# EAGLE schematic Extrudrboard2-thunk (EAGLE 6.2)
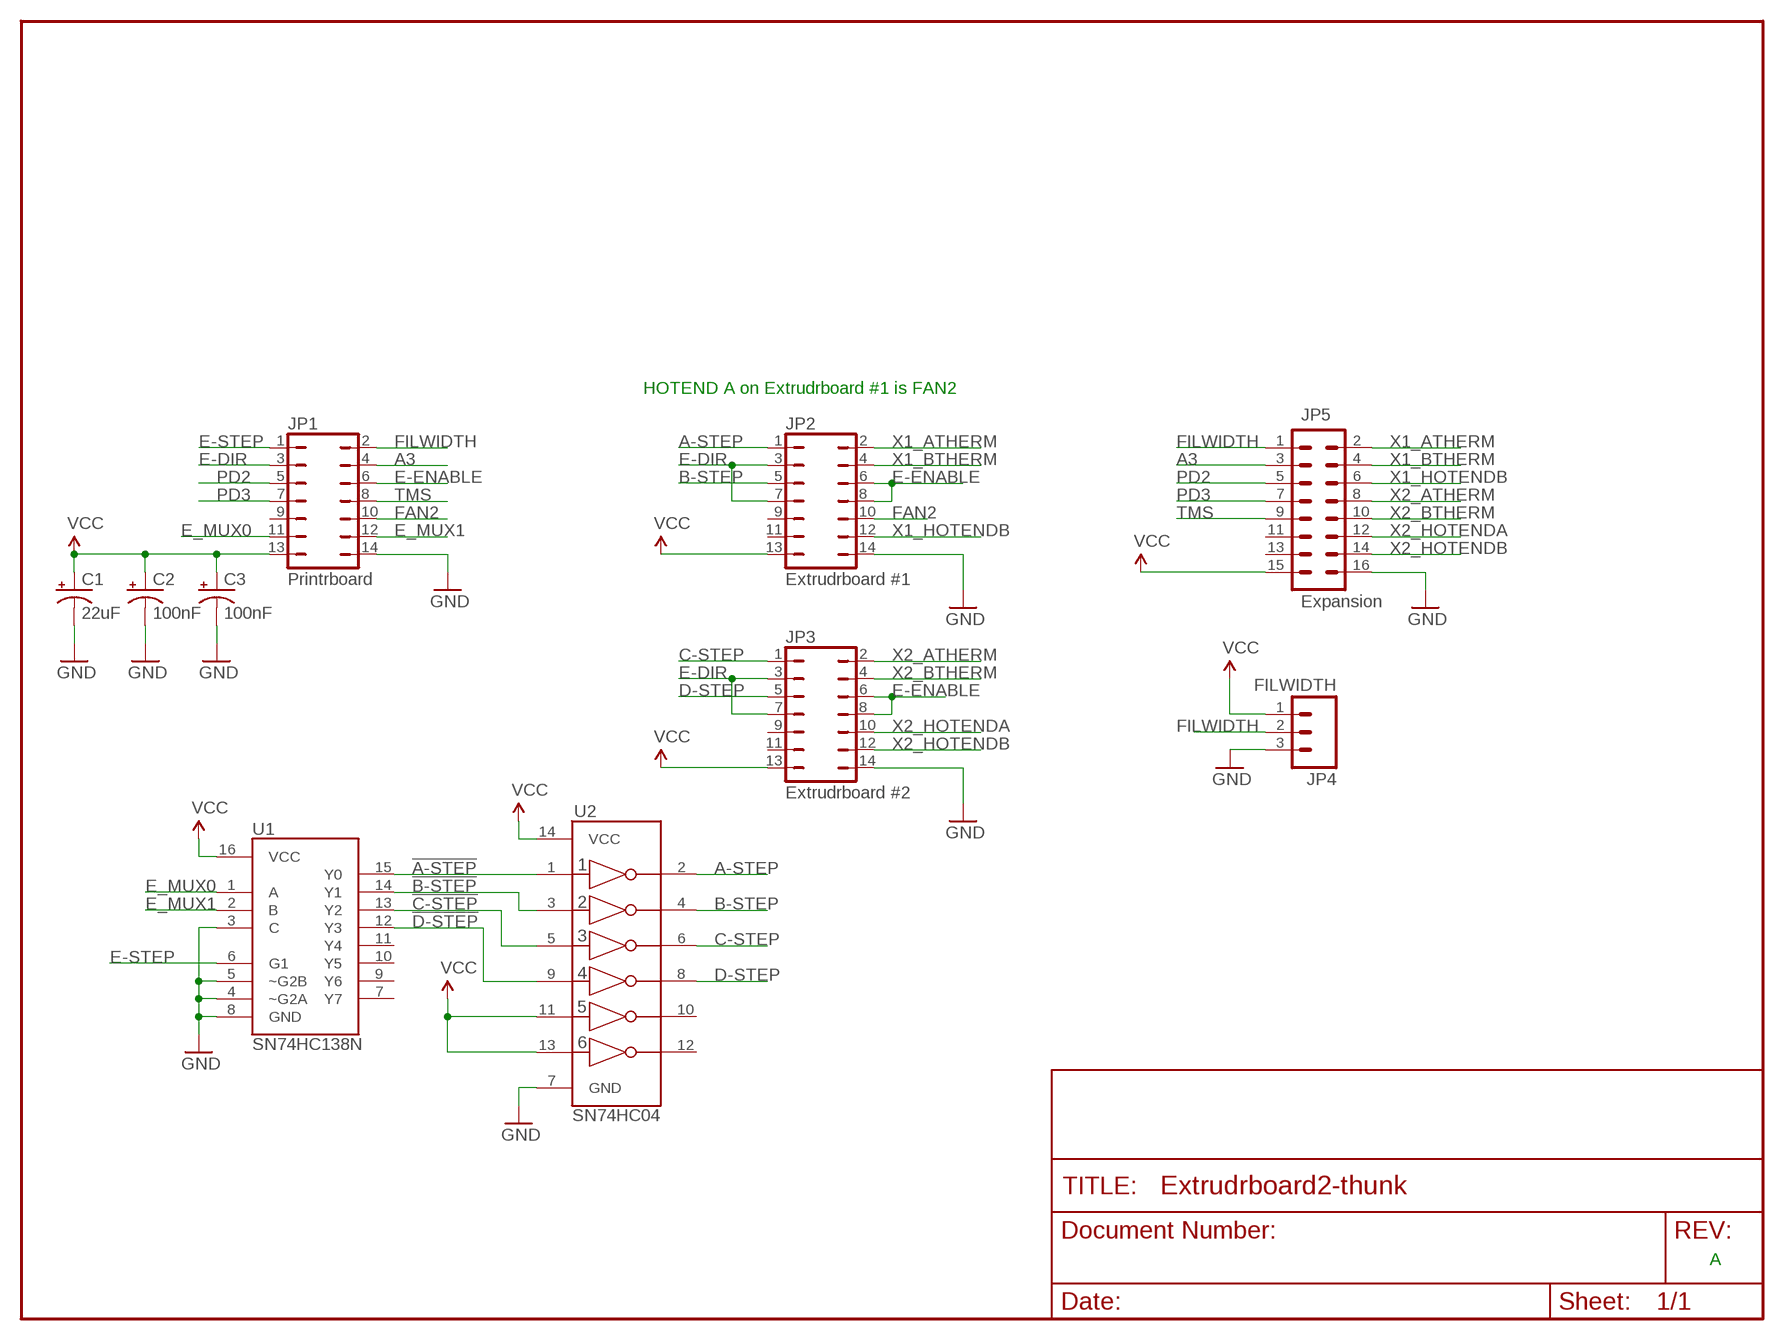
[diagram p0: schematic, sheet 1]

## Parts
C1  22uF  CAP_POLPTH1  [CPOL-RADIAL-100UF-25V]
C2  100nF  CAP_POLPTH2  [CPOL-RADIAL-10UF-25V]
C3  100nF  CAP_POLPTH2  [CPOL-RADIAL-10UF-25V]
JP1  Printrboard  JP7Q  [JP7Q]
JP2  Extrudrboard #1  JP7Q  [JP7Q]
JP3  Extrudrboard #2  JP7Q  [JP7Q]
JP4  FILWIDTH  M03PTH  [1X03]
JP5  Expansion  M08X2  [2X8]
U1  SN74HC138N  M74HC238  [DIL16]
U2  SN74HC04  74HC04_HEX_INVERTER  [DIL14]

## Nets
!A-STEP: U1.15(Y0) U2.1(1A)
!B-STEP: U1.14(Y1) U2.3(2A)
!C-STEP: U1.13(Y2) U2.5(3A)
!D-STEP: U1.12(Y3) U2.9(4A)
A3: JP1.4 JP5.3
A-STEP: JP2.1 U2.2(1Y)
B-STEP: JP2.5 U2.4(2Y)
C-STEP: JP3.1 U2.6(3Y)
D-STEP: JP3.5 U2.8(4Y)
E-DIR: JP1.3 JP2.3 JP2.7 JP3.3 JP3.7
E-ENABLE: JP1.6 JP2.6 JP2.8 JP3.6 JP3.8
E-STEP: JP1.1 U1.6(G1)
E_MUX0: JP1.11 U1.1(A)
E_MUX1: JP1.12 U1.2(B)
FAN2: JP1.10 JP2.10
FILWIDTH: JP1.2 JP4.2 JP5.1
GND [Power]: C1.2(-) C2.2(-) C3.2(-) JP1.14 JP2.14 JP3.14 JP4.3 JP5.16 U1.3(C) U1.4(~G2A) U1.5(~G2B) U1.8(GND) U2.7(GND)
PD2: JP1.5 JP5.5
PD3: JP1.7 JP5.7
TMS: JP1.8 JP5.9
VCC [Power]: C1.1(+) C2.1(+) C3.1(+) JP1.13 JP2.13 JP3.13 JP4.1 JP5.15 U1.16(VCC) U2.11(5A) U2.13(6A) U2.14(VCC)
X1_ATHERM: JP2.2 JP5.2
X1_BTHERM: JP2.4 JP5.4
X1_HOTENDB: JP2.12 JP5.6
X2_ATHERM: JP3.2 JP5.8
X2_BTHERM: JP3.4 JP5.10
X2_HOTENDA: JP3.10 JP5.12
X2_HOTENDB: JP3.12 JP5.14
Unconnected: JP1.9 JP2.9 JP2.11 JP3.9 JP3.11 JP5.11 JP5.13 U1.7(Y7) U1.9(Y6) U1.10(Y5) U1.11(Y4) U2.10(5Y) U2.12(6Y)

## Notes on the sheet
- HOTEND A on Extrudrboard #1 is FAN2
- A

## Library data of the parts
C1-C3 = SparkFun:CAP_POL: Capacitor Polarized These are standard SMD and PTH capacitors. Normally 10uF, 47uF, and 100uF in electrolytic and tantalum varieties. Always verify the external diameter of the through hole cap, it varies with capacity, voltage, and manufacturer. The EIA devices should be standard.
JP1-JP3 = printrbot:JP7Q: JUMPER
JP4 = SparkFun:M03: Header 3 Standard 3-pin 0.1" header. Use with straight break away headers (SKU : PRT-00116), right angle break away headers (PRT-00553), swiss pins (PRT-00743), machine pins (PRT-00117), and female headers (PRT-00115). Molex polarized connector foot print use with SKU : PRT-08232 with associated crimp pins and housings.
JP5 = SparkFun:M08X2
U1 = SparkFun:M74HC238: M74HC238 - CMOS 3 TO 8 LINE DECODER
U2 = SparkFun:74HC04_HEX_INVERTER: 74HC04 Hex Inverter

## Net classes
1 Power: width 0.813 mm